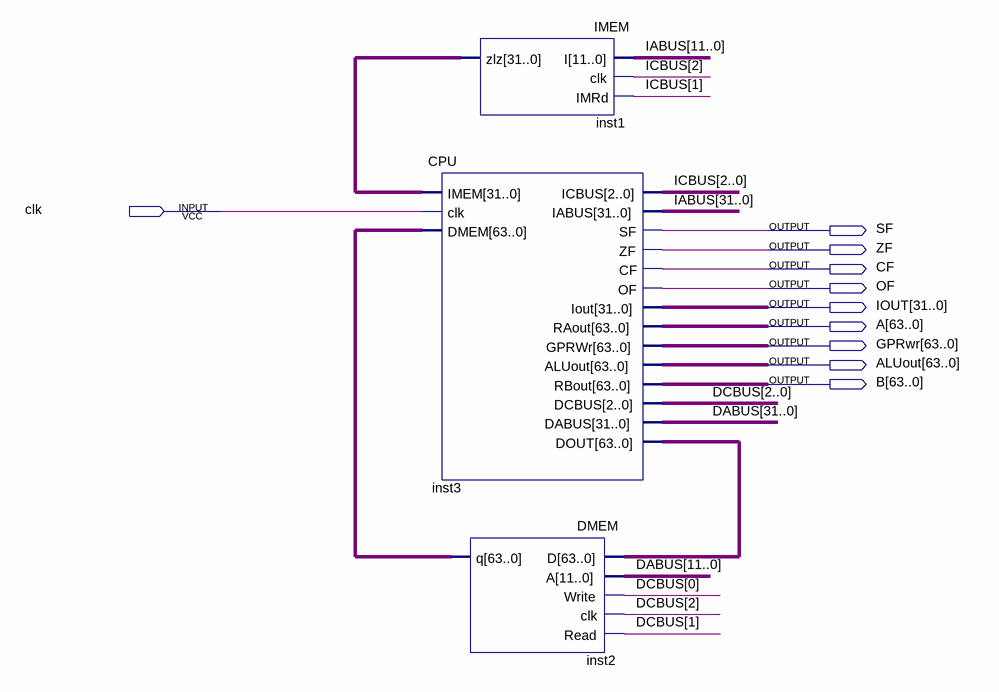
[diagram p0: schematic sheet]
// Quartus schematic HostMachine.bdf as structural Verilog: 3 symbols, 10 pins
module HostMachine (
  input  clk,
  output SF,
  output ZF,
  output CF,
  output OF,
  output [31:0] IOUT,
  output [63:0] A,
  output [63:0] GPRwr,
  output [63:0] ALUout,
  output [63:0] B
);

  wire [2:0] DCBUS, ICBUS;
  wire [31:0] DABUS, IABUS, inst1_zlz;
  wire [63:0] inst2_q, inst3_dout;

  IMEM inst1 (.I(IABUS[11:0]), .clk(ICBUS[2]), .IMRd(ICBUS[1]), .zlz(inst1_zlz));
  CPU inst3 (
    .IMEM(inst1_zlz), .clk(clk), .DMEM(inst2_q), .ICBUS(ICBUS), .IABUS(IABUS), .SF(SF), .ZF(ZF), .CF(CF),
    .OF(OF), .Iout(IOUT), .RAout(A), .GPRWr(GPRwr), .ALUout(ALUout), .RBout(B), .DCBUS(DCBUS), .DABUS(DABUS),
    .DOUT(inst3_dout));
  DMEM inst2 (.D(inst3_dout), .A(DABUS[11:0]), .Write(DCBUS[0]), .clk(DCBUS[2]), .Read(DCBUS[1]), .q(inst2_q));
endmodule
